# EAGLE design ButtonBox V3 (EAGLE 9.1.3)
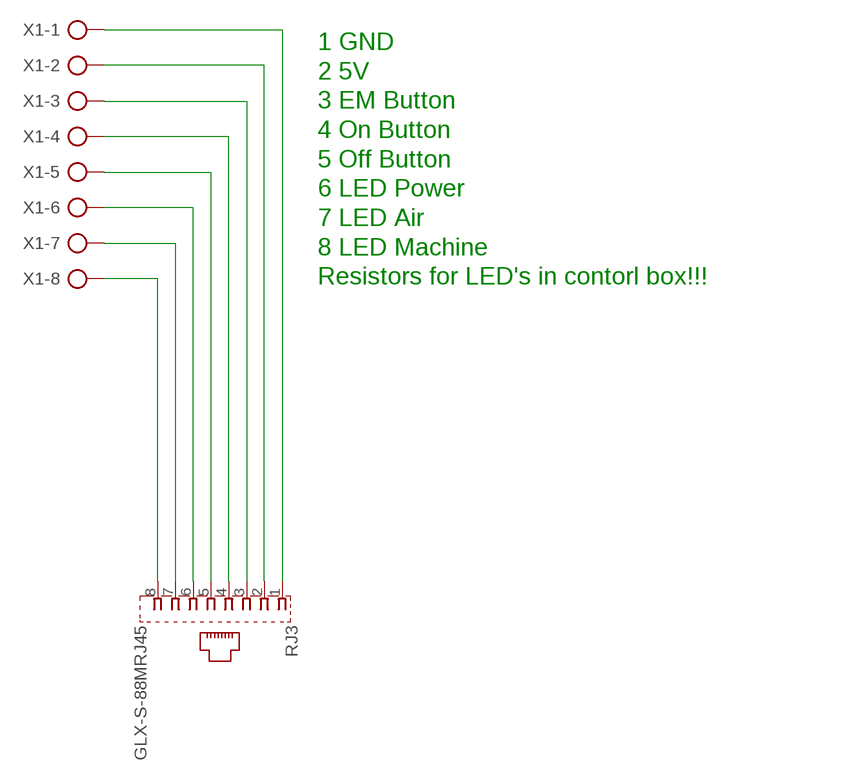
[diagram p0: schematic, sheet 1]

## Parts
RJ3  GLX-S-88MRJ45  [GLX-S-88M]
X1  AK500/8  [AK500/8]

## Nets
N$1: RJ3.8 X1.8
N$2: RJ3.7 X1.7
N$3: RJ3.6 X1.6
N$4: RJ3.5 X1.5
N$5: RJ3.3 X1.3
N$6: RJ3.4 X1.4
N$7: RJ3.1 X1.1
N$8: RJ3.2 X1.2

## Notes on the sheet
- 1 GND
  2 5V
  3 EM Button
  4 On Button
  5 Off Button
  6 LED Power
  7 LED Air
  8 LED Machine
  Resistors for LED's in contorl box!!!

## Library data of the parts
RJ3 = con-kyconedited:GLX-S-88M: Mod. Jack, Right Angle, 8 posiotion, 8 contatcs RJ45 Source: GLX-S-88M.pdf; OC_FARNELL: unknown; OC_NEWARK: unknown
X1 = con-ptr500:AK500/8: CONNECTOR; OC_FARNELL: unknown; OC_NEWARK: unknown

## Board
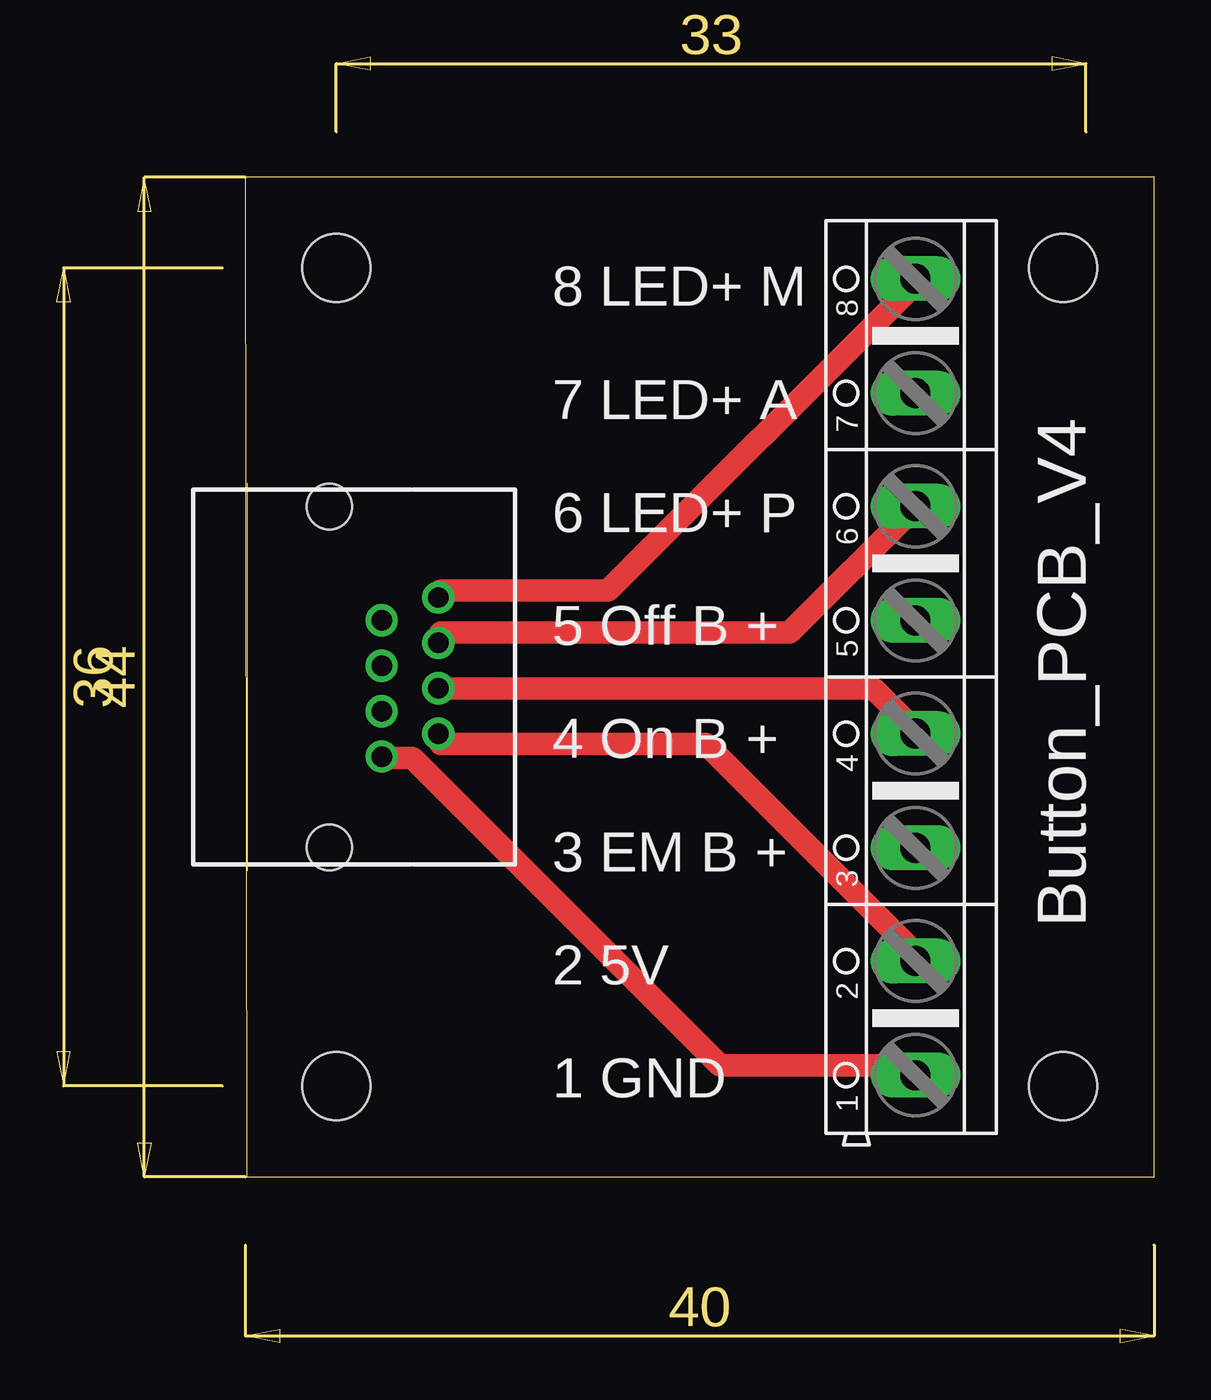
[diagram p1: board, top side]
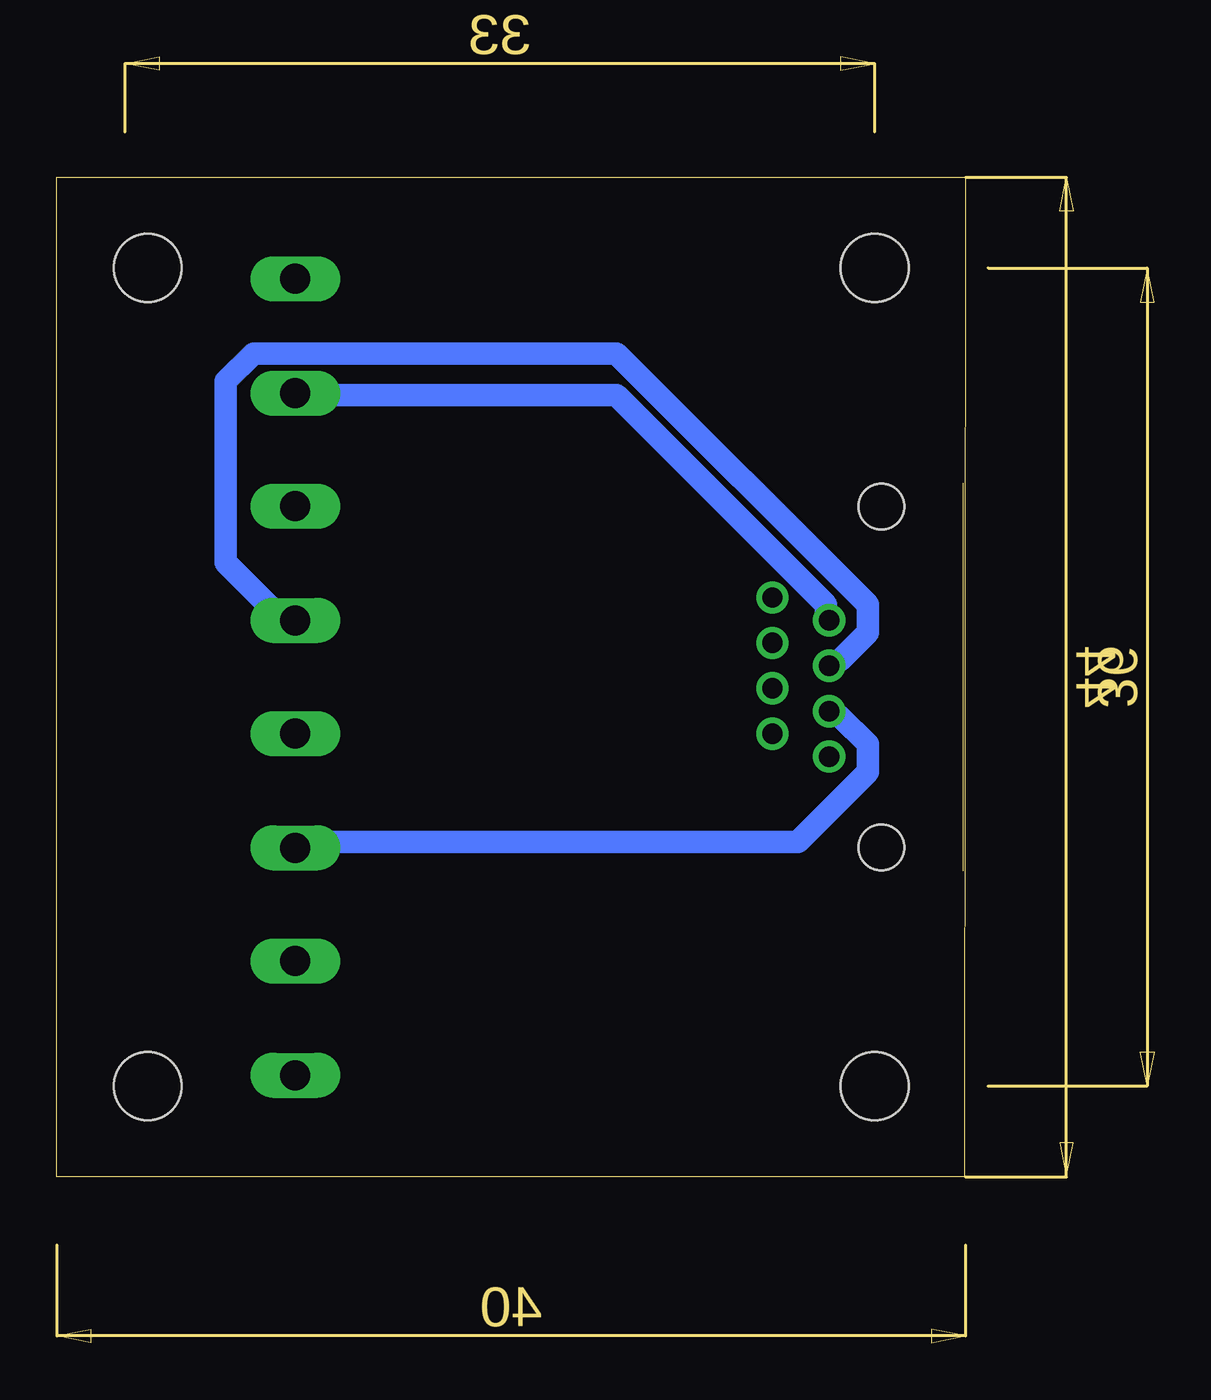
[diagram p2: board, bottom side, seen from below]

Size 40 x 44 mm. Coordinates in mm from the lower left corner, seen from the top.
Outline: 0.06,0 40,0 40,44 0,44 0.06,0
Copper layers (1*16): Top 0.035mm / dielectric 1.5mm / Bottom 0.035mm
Design rules "default *": minimum track width 1mm, minimum drill 0.35mm, track to track 9mil, track to pad 9mil, pad to pad 9mil, via to via 9mil, smd to smd 6mil, copper to edge 40mil, drill to drill 6mil, minimum pad ring 10mil, minimum via ring 8mil, stop-mask expansion 4mil, vias tented up to drill 0mil, thermal gap 10mil
Holes 3 mm at 4,4 4,40 36,40 36,4

### Footprints (pad centres in the part's own frame; a part is rotated, then mirrored left to right if it is on the bottom)
GLX-S-88M = drill 0.9 pad 1.422: 1 -3.5,-2; 2 -2.5,-4.5; 3 -1.5,-2; 4 -0.5,-4.5; 5 0.5,-2; 6 1.5,-4.5; 7 2.5,-2; 8 3.5,-4.5 | hole 2: -7.5,0.3; 7.5,0.3
AK500/8 = drill 1.321 long: 1 -17.526,0; 2 -12.497,0; 3 -7.518,0; 4 -2.489,0; 5 2.489,0; 6 7.518,0; 7 12.497,0; 8 17.526,0

### Placement (x,y rotation side)
RJ3  4,22 90 top
X1  29.5,22 90 top

### Tracks (layer width: path | path; a pad name or v marks a point on that pad's centre or on a via)
N$1
  Top 1: RJ3.8 8.6,25.8 15.97,25.8 29.49,39.31 X1.8
N$2
  Bottom 1: RJ3.7 6.14,24.57 6.14,25.19 15.36,34.4 29.49,34.4 X1.7
N$3
  Top 1: RJ3.6 8.6,23.96 23.96,23.96 29.49,29.49 X1.6
N$4
  Bottom 1: RJ3.5 5.53,22.73 4.3,23.96 4.3,25.19 15.36,36.24 31.33,36.24 32.56,35.02 32.56,27.03 30.1,24.57 X1.5
N$5
  Bottom 1: RJ3.3 5.53,20.27 4.3,19.04 4.3,17.82 7.37,14.74 29.49,14.74 X1.3
N$6
  Top 1: RJ3.4 8.6,21.5 27.64,21.5 29.49,19.66 X1.4
N$7
  Top 1: RJ3.1 6.14,18.43 7.37,18.43 20.89,4.91 29.49,4.91 X1.1
N$8
  Top 1: RJ3.2 8.6,19.04 20.27,19.04 29.49,9.83 X1.2

### Text on the board
tPlace: Button_PCB_V4
tNames: 8 LED+ M / 7 LED+ A / 6 LED+ P / 5 Off B + / 4 On B + / 3 EM B + / 2 5V / 1 GND